# EAGLE design untitled1 (EAGLE 9.3.2)
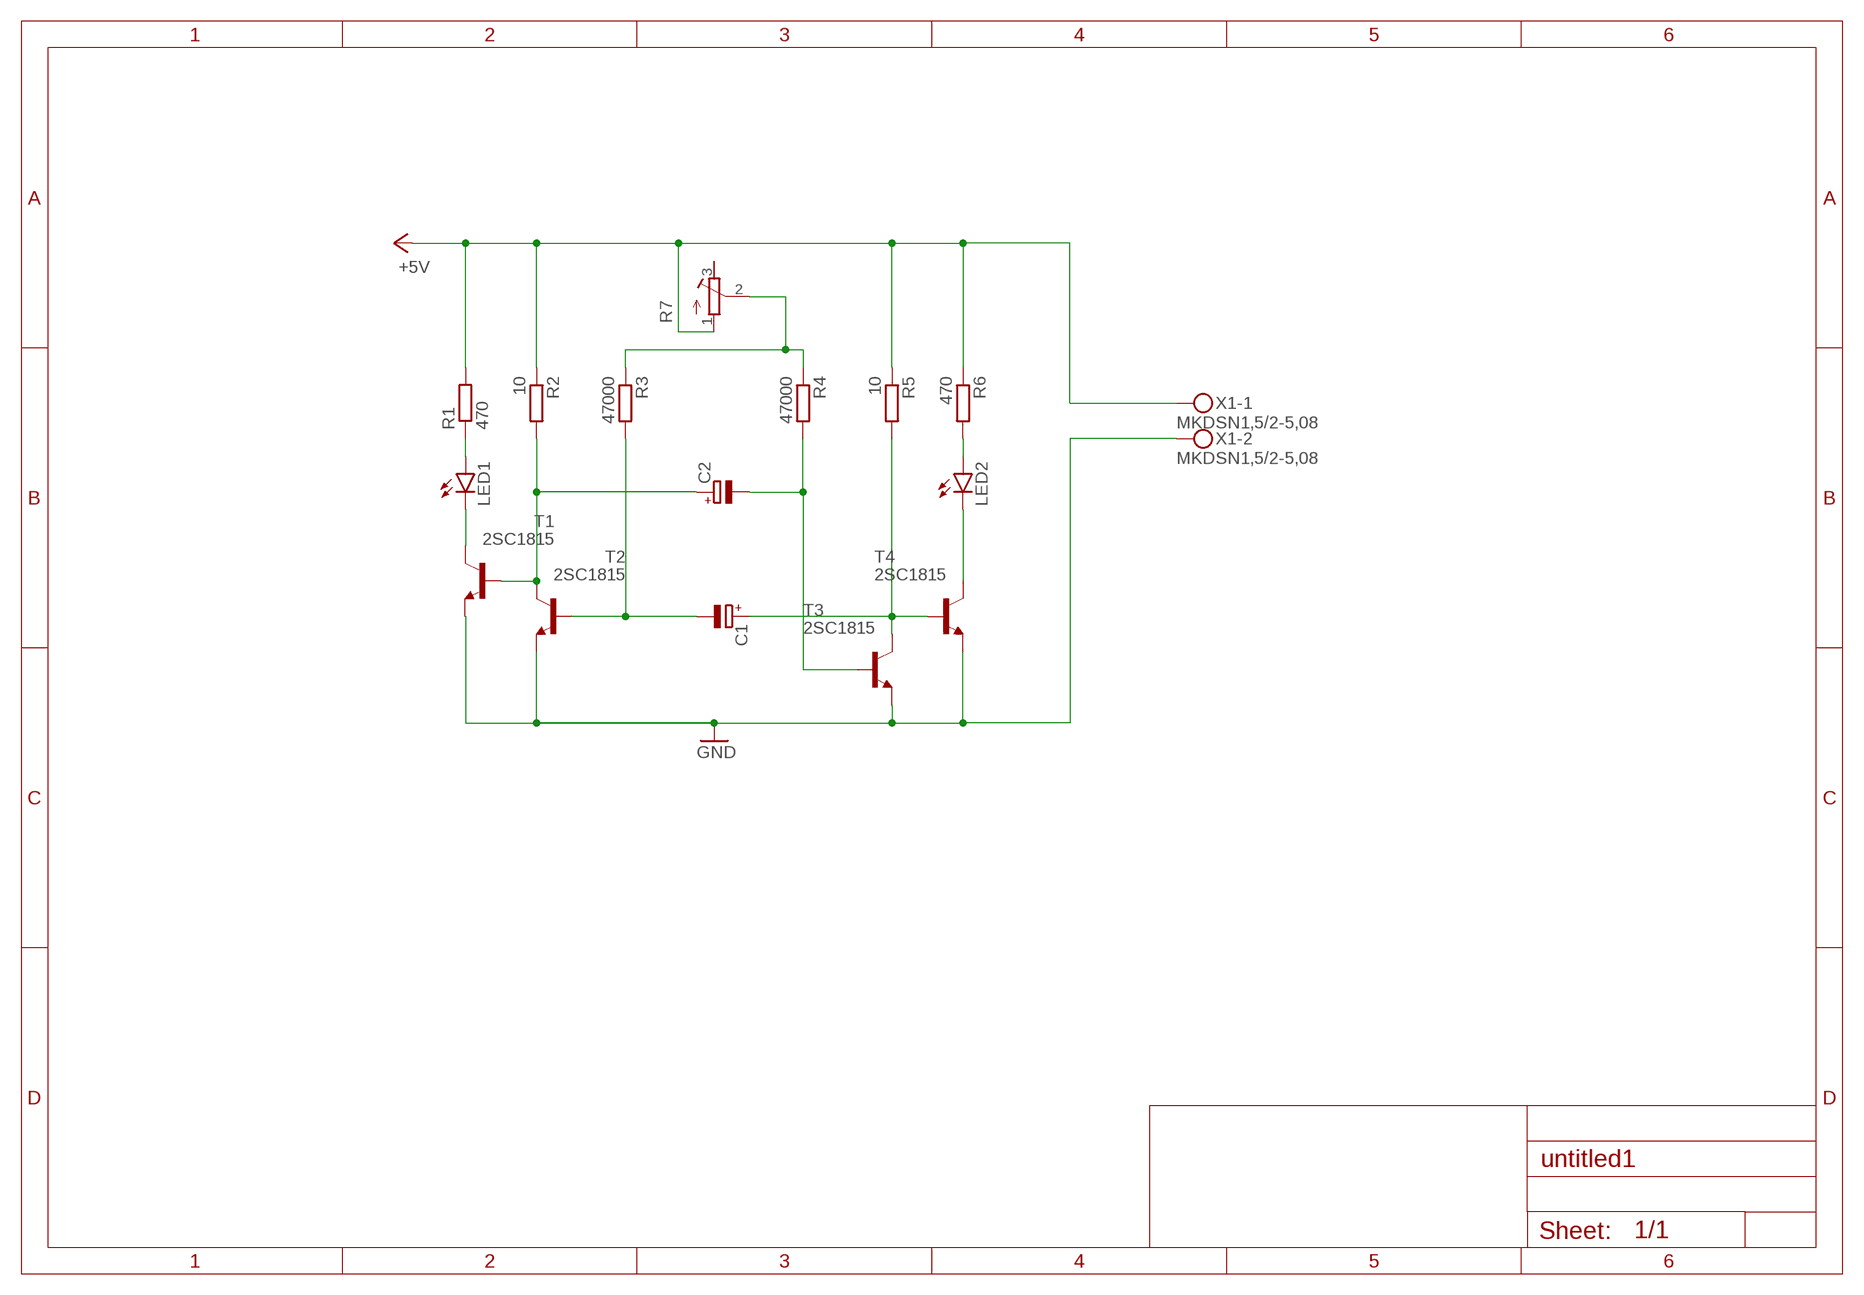
[diagram p0: schematic, sheet 1]

## Parts
C1  CPOL-EUE3.5-8  [E3,5-8]
C2  CPOL-EUE3.5-8  [E3,5-8]
LED1  LED5MM  [LED5MM]
LED2  LED5MM  [LED5MM]
R1  470  R-EU_0309/12  [0309/12]
R2  10  R-EU_0309/12  [0309/12]
R3  47000  R-EU_0309/12  [0309/12]
R4  47000  R-EU_0309/12  [0309/12]
R5  10  R-EU_0309/12  [0309/12]
R6  470  R-EU_0309/12  [0309/12]
R7  R-TRIMM74X  [RTRIM74X]
T1  2SC1815  [TO92-ECB]
T2  2SC1815  [TO92-ECB]
T3  2SC1815  [TO92-ECB]
T4  2SC1815  [TO92-ECB]
X1  MKDSN1,5/2-5,08  [MKDSN1,5/2-5,08]

## Nets
+5V: R1.2 R2.1 R5.1 R6.1 R7.1(A) X1.1
GND: T1.E T2.E T3.E T4.E X1.2
N$2: R3.1 R4.1 R7.2(S)
N$3: LED2.A R6.2
N$4: LED1.A R1.1
N$5: LED1.K(C) T1.C
N$6: C2.+ R2.2 T1.B T2.C
N$7: C1.- R3.2 T2.B
N$8: C2.- R4.2 T3.B
N$9: C1.+ R5.2 T3.C T4.B
N$10: LED2.K(C) T4.C
Unconnected: R7.3(E)

## Library data of the parts
C1 C2 = rcl:CPOL-EU: POLARIZED CAPACITOR, European symbol; SPICEPREFIX: C
LED1 LED2 = led:LED: LED OSRAM: - CHIPLED LG R971, LG N971, LY N971, LG Q971, LY Q971, LO R971, LY R971 LH N974, LH R974 LS Q976, LO Q976, LY Q976 LO Q996 - Hyper CHIPLED LW Q18S LB Q993, LB Q99A, LB R99A - SideLED LS A670, LO A670, LY A670, LG A670, LP A670 LB A673, LV A673, LT A673, LW A673 LH A674 LY A675 LS A676, LA A676, LO A676, LY A676, LW A676 LS A679, LY A679, LG A679 - Hyper Micro SIDELED® LS Y876, LA Y876, LO Y876, LY Y876 LT Y87S - SmartLED LW L88C, LW L88S LB L89C, LB L89S, LG L890 LS L89K, LO L89K, LY L89K LS L896, LA L896, LO L896, LY L896 - TOPLED LS T670, LO T670, LY T670, LG T670, LP T670 LSG T670, LSP T670, LSY T670, LOP T670, LYG T670 LG T671, LOG T671, LSG T671 LB T673, LV T673, LT T673, LW T673 LH T674 LS T676, LA T676, LO T676, LY T676, LB T676, LH T676, LSB T676, LW T676 LB T67C, LV T67C, LT T67C, LS T67K, LO T67K, LY T67K, LW E67C LS E67B, LA E67B, LO E67B, LY E67B, LB E67C, LV E67C, LT E67C LW T67C LS T679, LY T679, LG T679 LS T770, LO T770, LY T770, LG T770, LP T770 LB T773, LV T773, LT T773, LW T773 LH T774 LS E675, LA E675, LY E675, LS T675 LS T776, LA T776, LO T776, LY T776, LB T776 LHGB T686 LT T68C, LB T68C - Hyper Mini TOPLED® LB M676 - Mini TOPLED Santana® LG M470 LS M47K, LO M47K, LY M47K Source: http://www.osram.convergy.de LUXEON: - LUMILED® LXK2-PW12-R00, LXK2-PW12-S00, LXK2-PW14-U00, LXK2-PW14-V00 LXK2-PM12-R00, LXK2-PM12-S00, LXK2-PM14-U00 LXK2-PE12-Q00, LXK2-PE12-R00, LXK2-PE12-S00, LXK2-PE14-T00, LXK2-PE14-U00 LXK2-PB12-K00, LXK2-PB12-L00, LXK2-PB12-M00, LXK2-PB14-N00, LXK2-PB14-P00, LXK2-PB14-Q00 LXK2-PR12-L00, LXK2-PR12-M00, LXK2-PR14-Q00, LXK2-PR14-R00 LXK2-PD12-Q00, LXK2-PD12-R00, LXK2-PD12-S00 LXK2-PH12-R00, LXK2-PH12-S00 LXK2-PL12-P00, LXK2-PL12-Q00, LXK2-PL12-R00 Source: www.luxeon.com KINGBRIGHT: KA-3528ASYC Source: www.kingbright.com
R1-R6 = rcl:R-EU_: RESISTOR, European symbol; SPICEPREFIX: R
R7 = rcl:R-TRIMM: Trimm resistor; SPICEMODEL: X; SPICEPREFIXL: POT
T1-T4 = transistor:2SC1815: NPN EPITAXIAL TRANSISTOR Source: TOSHIBA .. 2SC1815 1.pdf
X1 = con-phoenix-508:MKDSN1,5/2-5,08: MKDSN 1,5/ 2-5,08 Printklemme Nennstrom: 13,5 A Nennspannung: 250 V Rastermaß: 5,08 mm Polzahl: 2 Anschlussart: Schraubanschluss Montage: Löten Anschlussrichtung Leiter/Platine: 0 ° Artikelnummer: 1729128 Source: http://eshop.phoenixcontact.com .. 1729128.pdf

## Board
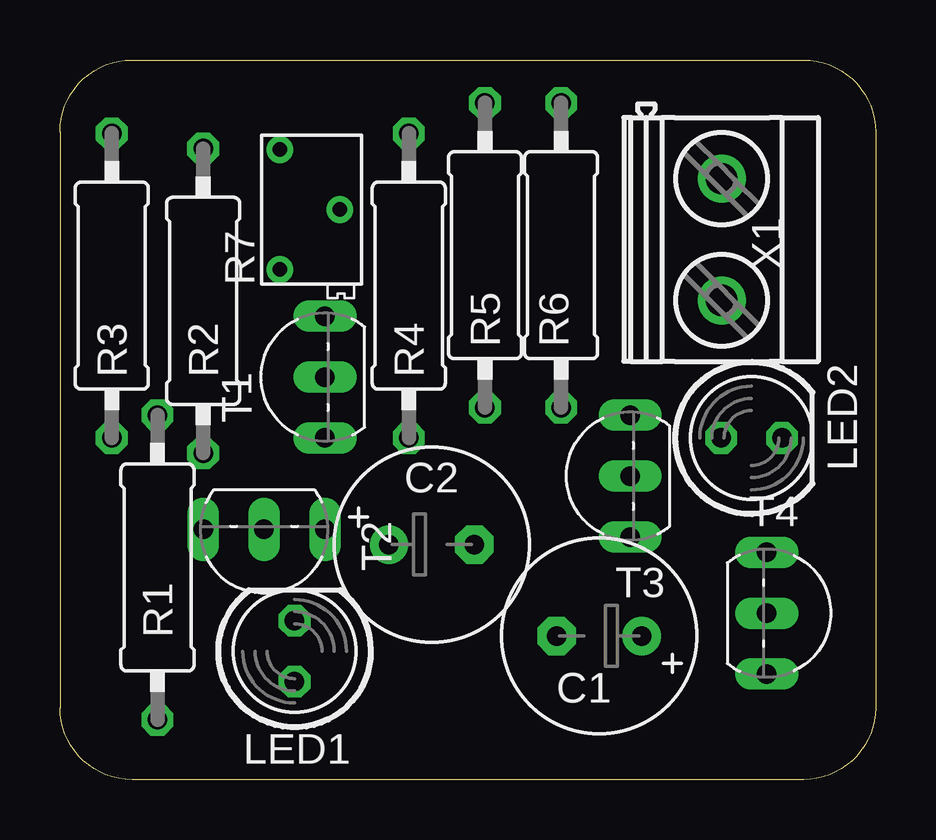
[diagram p1: board, top side]
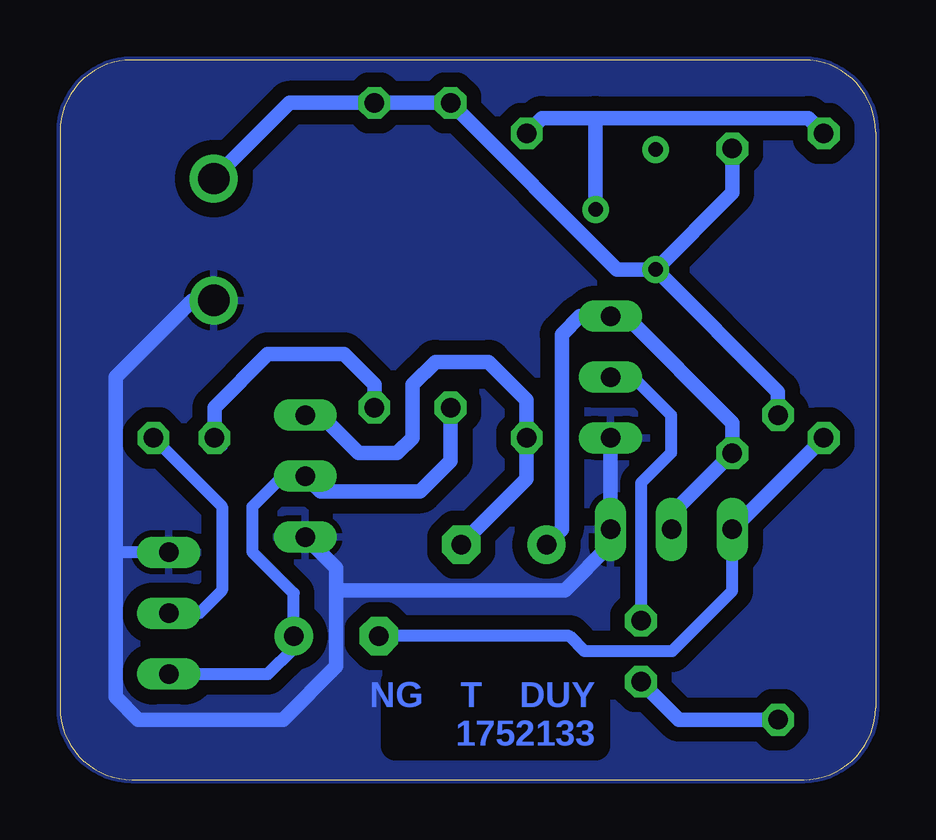
[diagram p2: board, bottom side, seen from below]

Size 34 x 30 mm. Coordinates in mm from the lower left corner, seen from the top.
Outline: 0,27 0,3 arc90 3,0 31,0 arc90 34,3 34,27 arc90 31,30 3,30 arc90 0,27
Copper layers (1*16): Top 0.035mm / dielectric 1.5mm / Bottom 0.035mm
Design rules "default *": minimum track width 6mil, minimum drill 0.35mm, track to track 6mil, track to pad 6mil, pad to pad 6mil, via to via 6mil, smd to smd 6mil, copper to edge 0mil, drill to drill 6mil, minimum pad ring 10mil, minimum via ring 8mil, stop-mask expansion 4mil, vias tented up to drill 0mil, thermal gap 10mil

### Footprints (pad centres in the part's own frame; a part is rotated, then mirrored left to right if it is on the bottom)
E3,5-8 = drill 0.813 pad 1.6: + -1.778,0 | drill 0.813 pad 1.6 octagon: - 1.778,0
LED5MM = drill 0.813 octagon: A -1.27,0; K 1.27,0
0309/12 = drill 0.813 octagon: 1 -6.35,0; 2 6.35,0
RTRIM74X = drill 0.61: 1 -1.25,-2.5; 2 1.25,0; 3 -1.25,2.5
TO92-ECB = drill 0.813 long: B 2.54,0; C 0,0; E -2.54,0
MKDSN1,5/2-5,08 = drill 1.3 pad 2: 1 -2.561,0.025; 2 2.519,0.025

### Placement (x,y rotation side)
C1  22.48,5.99 180 top
C2  15.5,9.79 0 top
LED1  9.78,5.35 90 top
LED2  28.83,14.24 0 top
R1  4.06,8.84 90 top
R2  5.97,19.95 270 top
R3  2.16,20.59 270 top
R4  14.54,20.59 270 top
R5  17.72,21.86 270 top
R6  20.89,21.86 270 top
R7  10.41,23.77 0 top
T1  11.05,16.78 90 top
T2  8.51,10.43 180 top
T3  23.78,12.65 90 top
T4  29.47,6.94 270 top
X1  27.56,22.5 270 top

### Tracks (layer width: path | path; a pad name or v marks a point on that pad's centre or on a via)
+5V
  Bottom 0.61: X1.1 24.43,28.21 R6.1 R5.1 10.77,21.27 R7.1 | R7.1 5.97,24.46 R2.1 | R7.1 4.06,16.16 R1.2
GND
  Bottom 0.508: 28.49,19.98 X1.2 | T4.E 31.69,9.48
  Bottom 0.61: T1.E T2.E 11.05,9.79 12.95,7.89 22.48,7.89 | T3.E 22.48,8.82 22.48,7.89 | 22.48,7.89 22.48,4.71 24.7,2.49 30.73,2.49 31.69,3.45 31.69,9.48 31.69,16.78 28.49,19.98
  pour Bottom (isolate 0.61): 0,27 arc-90 3,30 31,30 arc-90 34,27 34,3 arc-90 31,0 3,0 arc-90 0,3
N$2
  Bottom 0.61: R4.1 13.91,27.57 11.68,27.57 | 11.68,27.57 2.79,27.57 R3.1 | R7.2 11.68,23.79 11.68,27.57
N$3
  Bottom 0.508: LED2.A 27.24,13.92
  Bottom 0.61: LED2.A 27.56,15.51 25.34,17.73 22.16,17.73 20.89,16.46 R6.2
N$4
  Bottom 0.61: R1.1 8.19,2.49 LED1.A
N$5
  Bottom 0.508: T1.C 10.11,16.78 8.52,15.19 8.52,13.62 9.78,12.36 LED1.K
N$6
  Bottom 0.61: C2.+ 13.08,10.43 13.08,18.56 12.32,19.32 T1.B 10.41,19.32 5.97,14.88 R2.2 8.51,11.06 T2.C
N$7
  Bottom 0.508: T2.B 5.97,7.87 8.48,5.35 12.13,5.35 12.77,5.99 C1.-
  Bottom 0.61: T2.B R3.2
N$8
  Bottom 0.61: C2.- 14.54,12.53 R4.2 14.54,15.83 16.13,17.41 18.35,17.41 19.3,16.46 19.3,14.24 19.94,13.61 21.55,13.61 23.14,15.19 T3.B
N$9
  Bottom 0.508: 24.7,12.65 25.98,11.37 25.98,9.49 24.26,7.76 C1.+ 24.26,5.48 25.34,4.4 T4.B
  Bottom 0.61: R5.2 17.72,13.29 18.99,12.02 23.14,12.02 T3.C 24.7,12.65
N$10
  Bottom 0.508: LED2.K 27.24,11.38 27.24,7.89 28.2,6.94 T4.C

### Text on the board
Bottom: NGỌ TỪ DUY / 1752133